# EAGLE design mtr (EAGLE 9.4.2)
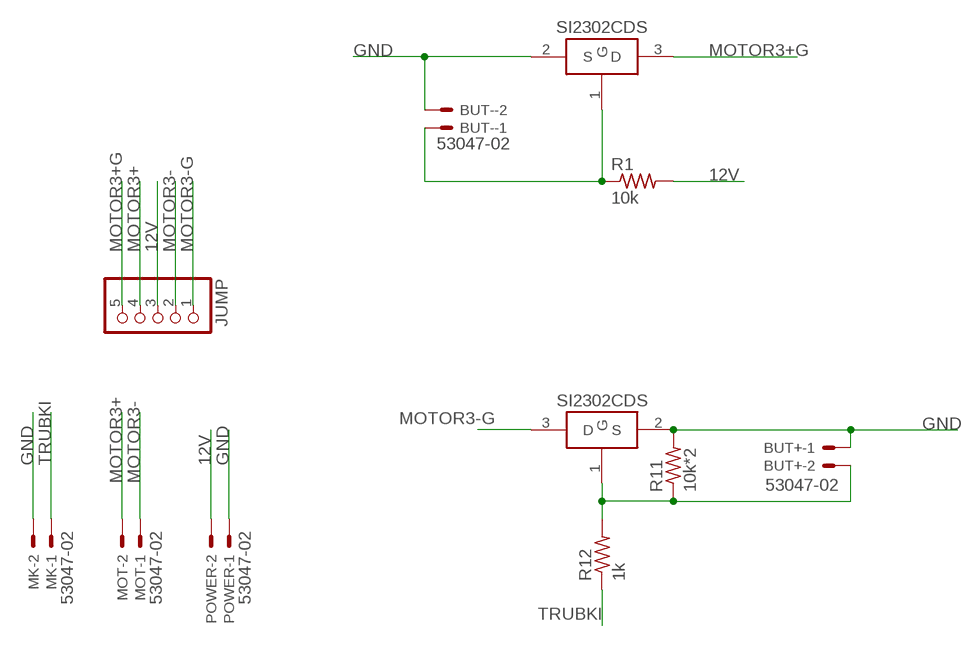
[diagram p0: schematic, sheet 1]

## Parts
BUT+  53047-02  [53047-02]
BUT-  53047-02  [53047-02]
JUMP  PINHD-1X5  [1X05]
MK  53047-02  [53047-02]
MOT  53047-02  [53047-02]
POWER  53047-02  [53047-02]
R1  10k  R-US_R0603  [R0603]
R11  10k*2  R-US_R0603  [R0603]
R12  1k  R-US_R0603  [R0603]
U$1  SI2302CDS  [SOT23-3]
U$21  SI2302CDS  [SOT23-3]

## Nets
12V: JUMP.3 POWER.2 R1.2
GND: BUT+.1 BUT-.2 MK.2 POWER.1 R11.2 U$1.2(S) U$21.2(S)
MOTOR3+: JUMP.4 MOT.2
MOTOR3+G: JUMP.5 U$21.3(D)
MOTOR3-: JUMP.2 MOT.1
MOTOR3-G: JUMP.1 U$1.3(D)
N$1: BUT-.1 R1.1 U$21.1(G)
N$17: BUT+.2 R11.1 R12.2 U$1.1(G)
TRUBKI: MK.1 R12.1

## Library data of the parts
BUT+ BUT- MK MOT POWER = con-molex:53?-02: CONNECTOR wire to board 1.25 mm (.049 inch) pitch header; MF: MOLEX; MPN: 53047-0210; OC_FARNELL: 9733051; OC_NEWARK: 57H4701
JUMP = pinhead:PINHD-1X5: PIN HEADER
R1 R11 R12 = rcl:R-US_: RESISTOR, American symbol; SPICEPREFIX: R
U$1 U$21 = CanCubeSat:SI2302CDS

## Board
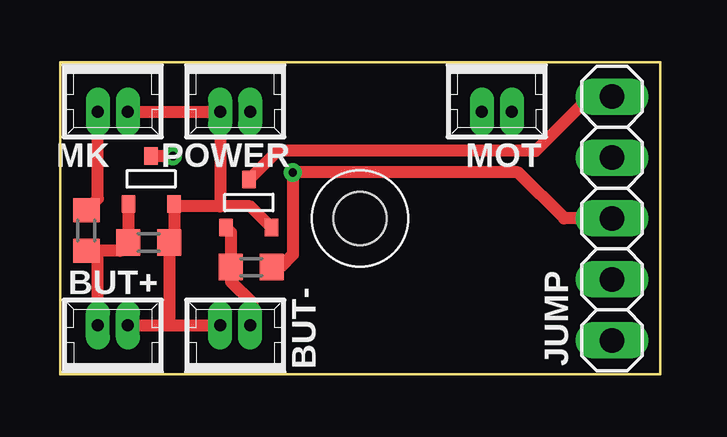
[diagram p1: board, top side]
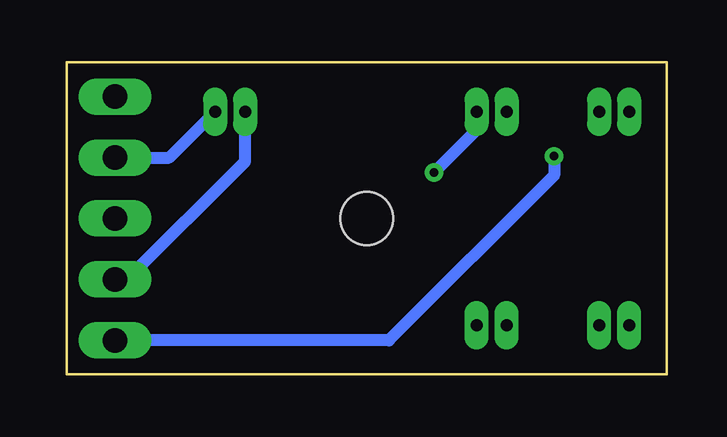
[diagram p2: board, bottom side, seen from below]

Size 25 x 13 mm. Coordinates in mm from the lower left corner, seen from the top.
Outline: 0,0 25,0 25,13 0,13 0,0
Copper layers (1*16): Top 0.035mm / dielectric 1.5mm / Bottom 0.035mm
Design rules "default *": minimum track width 0.25mm, minimum drill 0.35mm, track to track 0.2mm, track to pad 0.2mm, pad to pad 0.15mm, via to via 0.2mm, smd to smd 0.2mm, copper to edge 0.25mm, drill to drill 0.1mm, minimum pad ring 10mil, minimum via ring 8mil, stop-mask expansion 4mil, vias tented up to drill 0mil, thermal gap 10mil
Holes 2.2 mm at 12.5,6.5

### Footprints (pad centres in the part's own frame; a part is rotated, then mirrored left to right if it is on the bottom)
53047-02 = drill 0.5 pad 0.698 long: 1 0.625,0.45; 2 -0.625,0.45
1X05 = drill 1.016 long: 1 -5.08,0; 2 -2.54,0; 3 0,0; 4 2.54,0; 5 5.08,0
R0603 = smd 1 x 1.1: 1 -0.85,0; 2 0.85,0
SOT23-3 = smd 0.56 x 0.73: 1 -0.95,-1; 2 0.95,-1; 3 0,1

### Placement (x,y rotation side)
BUT+  2.2,1.6 0 top
BUT-  7.3,1.6 0 top
JUMP  23,6.5 90 top
MK  2.2,11.4 180 top
MOT  18.2,11.4 180 top
POWER  7.3,11.4 180 top
R1  7.97,4.48 0 top
R11  3.7,5.5 0 top
R12  1.1,6 270 top
U$1  3.8,8.1 0 top
U$21  7.87,7.12 0 top

### Tracks (layer width: path | path; a pad name or v marks a point on that pad's centre or on a via)
12V  (via drill 0.35)
  Top 0.5: JUMP.3 21,6.5 19.08,8.42 v9.7,8.42 9.7,5 9.18,4.48 R1.2
  Bottom 0.5: POWER.2 7.92,10.19 v9.7,8.42
GND
  Top 0.5: BUT+.1 4.7,2.05 | 4.7,2.05 BUT-.2 | MK.2 POWER.1 6.67,7 | U$21.2 7.94,7 6.67,7 | 6.67,7 4.85,7 U$1.2 4.75,5.7 R11.2 4.55,2.2 4.7,2.05
MOTOR3+
  Bottom 0.5: JUMP.4 20.73,9.04 MOT.2
MOTOR3+G
  Top 0.5: U$21.3 9.07,9.32 19.82,9.32 22.08,11.58 JUMP.5
MOTOR3-
  Bottom 0.5: JUMP.2 22.5,3.96 17.57,8.88 MOT.1
MOTOR3-G  (via drill 0.35)
  Top 0.5: v4.7,9.1 U$1.3
  Bottom 0.5: v4.7,9.1 4.7,8.3 11.58,1.42 JUMP.1
N$1
  Top 0.5: BUT-.1 8,2.12 8,3 7.12,3.88 R1.1 7.12,5.92 U$21.1
N$17
  Top 0.5: U$1.1 R11.1 2.5,5.15 R12.2 1.57,5.15 BUT+.2
TRUBKI
  Top 0.5: R12.1 1.57,7.33 MK.1